# EAGLE design solenoid-driver (EAGLE 8.2.2)
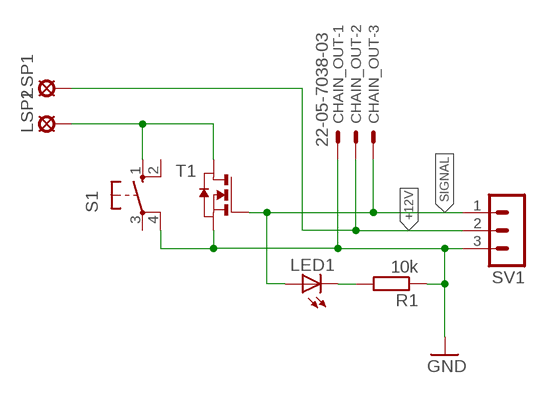
[diagram p0: schematic, sheet 1]

## Parts
CHAIN_OUT  22-05-7038-03  [7395-03]
LED1  LEDCHIPLED_1206  [CHIPLED_1206]
LSP1  LSP13  [LSP13]
LSP2  LSP13  [LSP13]
R1  10k  R-EU_M0805  [M0805]
S1  10-XX  [B3F-10XX]
SV1  MA03-1  [MA03-1]
T1  NMOSSOT23  [SOT-23]

## Nets
+12V: CHAIN_OUT.2 LSP1.MP SV1.2
GND: CHAIN_OUT.1 R1.1 S1.4(P1) SV1.3 T1.2(S)
N$1: LSP2.MP S1.1(S) T1.1(D)
N$2: LED1.C R1.2
SIGNAL: CHAIN_OUT.3 LED1.A SV1.1 T1.3(G)
Unconnected: S1.2(S1) S1.3(P)

## Library data of the parts
CHAIN_OUT = con-molex:22-?-03: CONNECTOR wire to board 2.54 mm (.1 inch) pitch header; OC_FARNELL: unknown; OC_NEWARK: unknown; TME: FCI 76382-303LF
LED1 = led:LED: LED OSRAM: - CHIPLED LG R971, LG N971, LY N971, LG Q971, LY Q971, LO R971, LY R971 LH N974, LH R974 LS Q976, LO Q976, LY Q976 LO Q996 - Hyper CHIPLED LW Q18S LB Q993, LB Q99A, LB R99A - SideLED LS A670, LO A670, LY A670, LG A670, LP A670 LB A673, LV A673, LT A673, LW A673 LH A674 LY A675 LS A676, LA A676, LO A676, LY A676, LW A676 LS A679, LY A679, LG A679 - Hyper Micro SIDELED® LS Y876, LA Y876, LO Y876, LY Y876 LT Y87S - SmartLED LW L88C, LW L88S LB L89C, LB L89S, LG L890 LS L89K, LO L89K, LY L89K LS L896, LA L896, LO L896, LY L896 - TOPLED LS T670, LO T670, LY T670, LG T670, LP T670 LSG T670, LSP T670, LSY T670, LOP T670, LYG T670 LG T671, LOG T671, LSG T671 LB T673, LV T673, LT T673, LW T673 LH T674 LS T676, LA T676, LO T676, LY T676, LB T676, LH T676, LSB T676, LW T676 LB T67C, LV T67C, LT T67C, LS T67K, LO T67K, LY T67K, LW E67C LS E67B, LA E67B, LO E67B, LY E67B, LB E67C, LV E67C, LT E67C LW T67C LS T679, LY T679, LG T679 LS T770, LO T770, LY T770, LG T770, LP T770 LB T773, LV T773, LT T773, LW T773 LH T774 LS E675, LA E675, LY E675, LS T675 LS T776, LA T776, LO T776, LY T776, LB T776 LHGB T686 LT T68C, LB T68C - Hyper Mini TOPLED® LB M676 - Mini TOPLED Santana® LG M470 LS M47K, LO M47K, LY M47K Source: http://www.osram.convergy.de LUXEON: - LUMILED® LXK2-PW12-R00, LXK2-PW12-S00, LXK2-PW14-U00, LXK2-PW14-V00 LXK2-PM12-R00, LXK2-PM12-S00, LXK2-PM14-U00 LXK2-PE12-Q00, LXK2-PE12-R00, LXK2-PE12-S00, LXK2-PE14-T00, LXK2-PE14-U00 LXK2-PB12-K00, LXK2-PB12-L00, LXK2-PB12-M00, LXK2-PB14-N00, LXK2-PB14-P00, LXK2-PB14-Q00 LXK2-PR12-L00, LXK2-PR12-M00, LXK2-PR14-Q00, LXK2-PR14-R00 LXK2-PD12-Q00, LXK2-PD12-R00, LXK2-PD12-S00 LXK2-PH12-R00, LXK2-PH12-S00 LXK2-PL12-P00, LXK2-PL12-Q00, LXK2-PL12-R00 Source: www.luxeon.com KINGBRIGHT: KA-3528ASYC Source: www.kingbright.com
LSP1 LSP2 = solpad:LSP13: SOLDER PAD drill 1.3 mm, distributor Buerklin, 12H562
R1 = resistor:R-EU_: RESISTOR, European symbol
S1 = switch-omron:10-XX: OMRON SWITCH; MPN: B3F-1000; OC_FARNELL: 176432; OC_NEWARK: 36M3542
SV1 = con-lstb:MA03-1: PIN HEADER; OC_FARNELL: unknown; OC_NEWARK: unknown
T1 = zetex:NMOSSOT23: MOS FET; OC_FARNELL: unknown; OC_NEWARK: unknown; TME: TSM2312CX

## Board
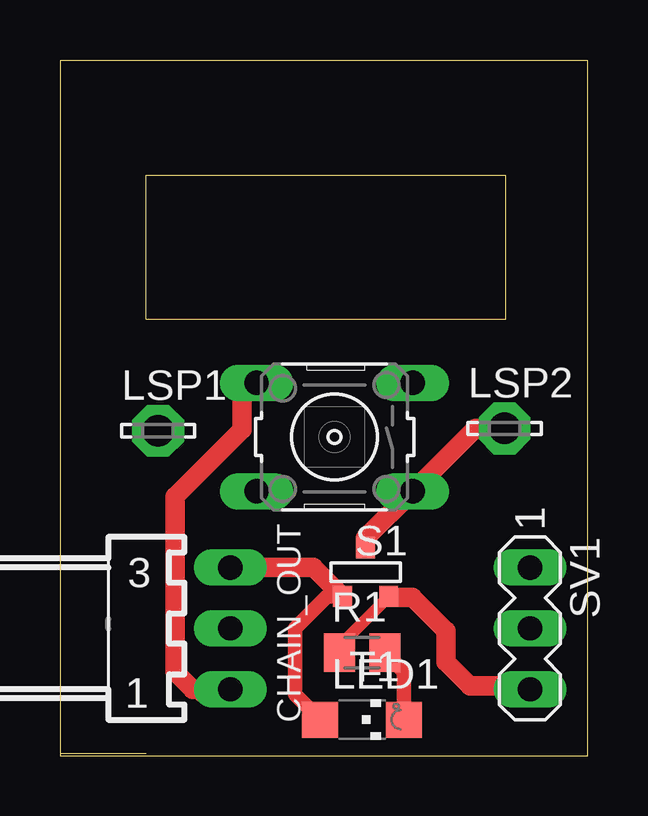
[diagram p1: board, top side]
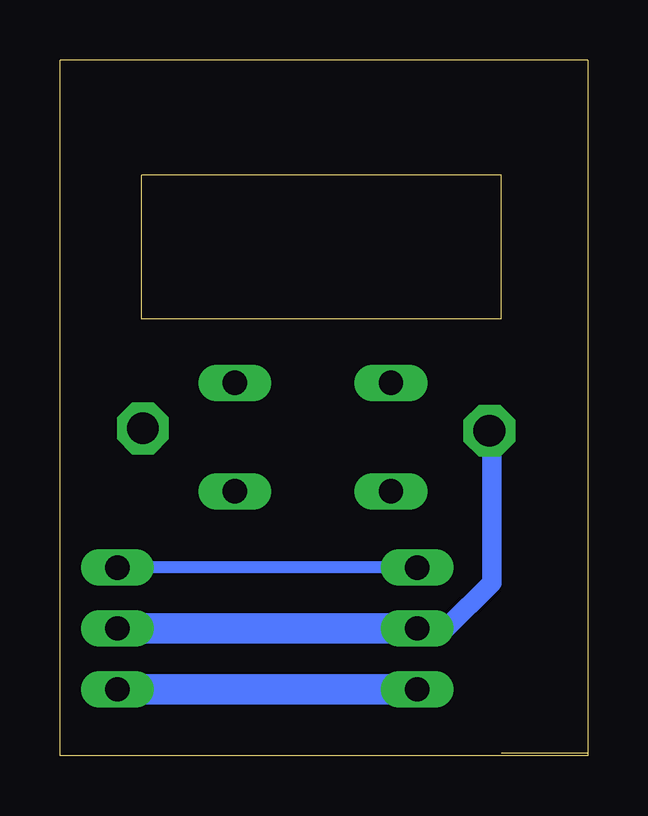
[diagram p2: board, bottom side, seen from below]

Size 22 x 29 mm. Coordinates in mm from the lower left corner, seen from the top.
Outline: 0,0.1 0,29 22,29 22,0 0,0 0,0.1
Outline: 0,0.1 3.6,0.1
Copper layers (1*16): Top 0.035mm / dielectric 1.5mm / Bottom 0.035mm
Design rules "default *": minimum track width 6mil, minimum drill 0.35mm, track to track 6mil, track to pad 6mil, pad to pad 6mil, via to via 6mil, smd to smd 6mil, copper to edge 10mil, drill to drill 6mil, minimum pad ring 10mil, minimum via ring 8mil, stop-mask expansion 4mil, vias tented up to drill 0mil, thermal gap 10mil
Milling: 4 lines

### Footprints (pad centres in the part's own frame; a part is rotated, then mirrored left to right if it is on the bottom)
7395-03 = drill 1.016 long: 1 2.54,0; 2 0,0; 3 -2.54,0
CHIPLED_1206 = smd 1.5 x 1.5: A 0,-1.75; C 0,1.75
LSP13 = drill 1.321 pad 2.159 octagon: MP 0,0
M0805 = smd 1.3 x 1.6: 1 -0.95,0; 2 0.95,0
B3F-10XX = drill 1.016 long: 1 -3.251,2.261; 2 3.251,2.261; 3 -3.251,-2.261; 4 3.251,-2.261
MA03-1 = drill 1.016 long: 1 -2.54,0; 2 0,0; 3 2.54,0
SOT-23 = smd 0.787 x 0.889: 1 0.025,-1.016; 2 -0.94,1.016; 3 0.991,1.016

### Placement (x,y rotation side)
CHAIN_OUT  7.1,5.3 270 top
LED1  12.6,1.5 270 top
LSP1  4.09,13.54 0 top
LSP2  18.54,13.64 0 top
R1  12.6,4.3 0 top
S1  11.45,13.28 180 top
SV1  19.6,5.3 270 top
T1  12.77,7.65 180 top

### Tracks (layer width: path | path; a pad name or v marks a point on that pad's centre or on a via)
+12V
  Bottom 0.813: LSP1.MP 4,13.45 4,7.2 5.9,5.3 CHAIN_OUT.2
  Bottom 1.27: CHAIN_OUT.2 SV1.2
GND
  Top 0.508: T1.2 11.65,4.57
  Top 0.61: 19.54,2.7 SV1.3 | 11.65,4.57 R1.1
  Top 0.813: SV1.3 19.46,2.9 17.1,2.9 16.1,3.9 16.1,5.2 14.7,6.6 13.74,6.6 T1.2 | CHAIN_OUT.1 5.54,2.76 4.8,3.5 4.8,10.8 7.6,13.6 7.6,14.94 S1.4
  Top 1.016: 6,2.7 7.04,2.7 CHAIN_OUT.1
  Bottom 1.27: CHAIN_OUT.1 SV1.3
N$1
  Top 0.813: T1.1 12.74,9.06 S1.1 17.32,13.64 LSP2.MP
N$2
  Top 0.61: R1.2 14.35,3.5 LED1.C
SIGNAL
  Top 0.61: T1.3 11.13,6.63 9.8,5.3 9.8,2.55 LED1.A
  Top 0.813: T1.3 10.57,7.84 CHAIN_OUT.3
  Bottom 0.508: CHAIN_OUT.3 SV1.1

### Text on the board
tDocu: VALVE DRIVER | + | - | OUT | sig | +12v | gnd